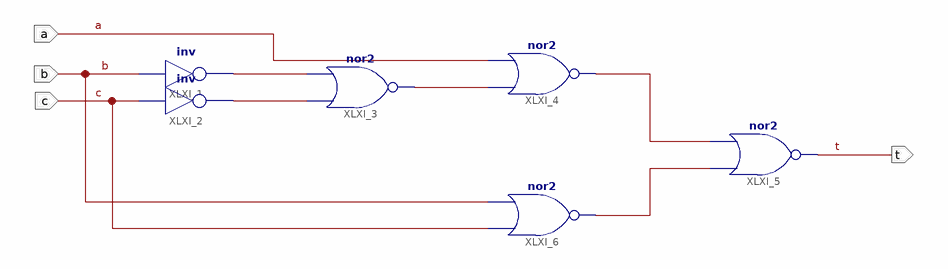
[diagram p0: schematic sheet 1]
// Xilinx ISE schematic circuit2.sch (spartan3e) as structural Verilog: 6 symbols, 4 ports
module circuit2 (
  input  a,
  input  b,
  input  c,
  output t
);

  wire XLXN_1, XLXN_2, XLXN_3, XLXN_4, XLXN_5;

  not XLXI_1 (XLXN_1, b);
  not XLXI_2 (XLXN_2, c);
  nor XLXI_3 (XLXN_3, XLXN_2, XLXN_1);
  nor XLXI_4 (XLXN_4, XLXN_3, a);
  nor XLXI_5 (t, XLXN_5, XLXN_4);
  nor XLXI_6 (XLXN_5, c, b);
endmodule
